# Altium project Buck.PrjPcb
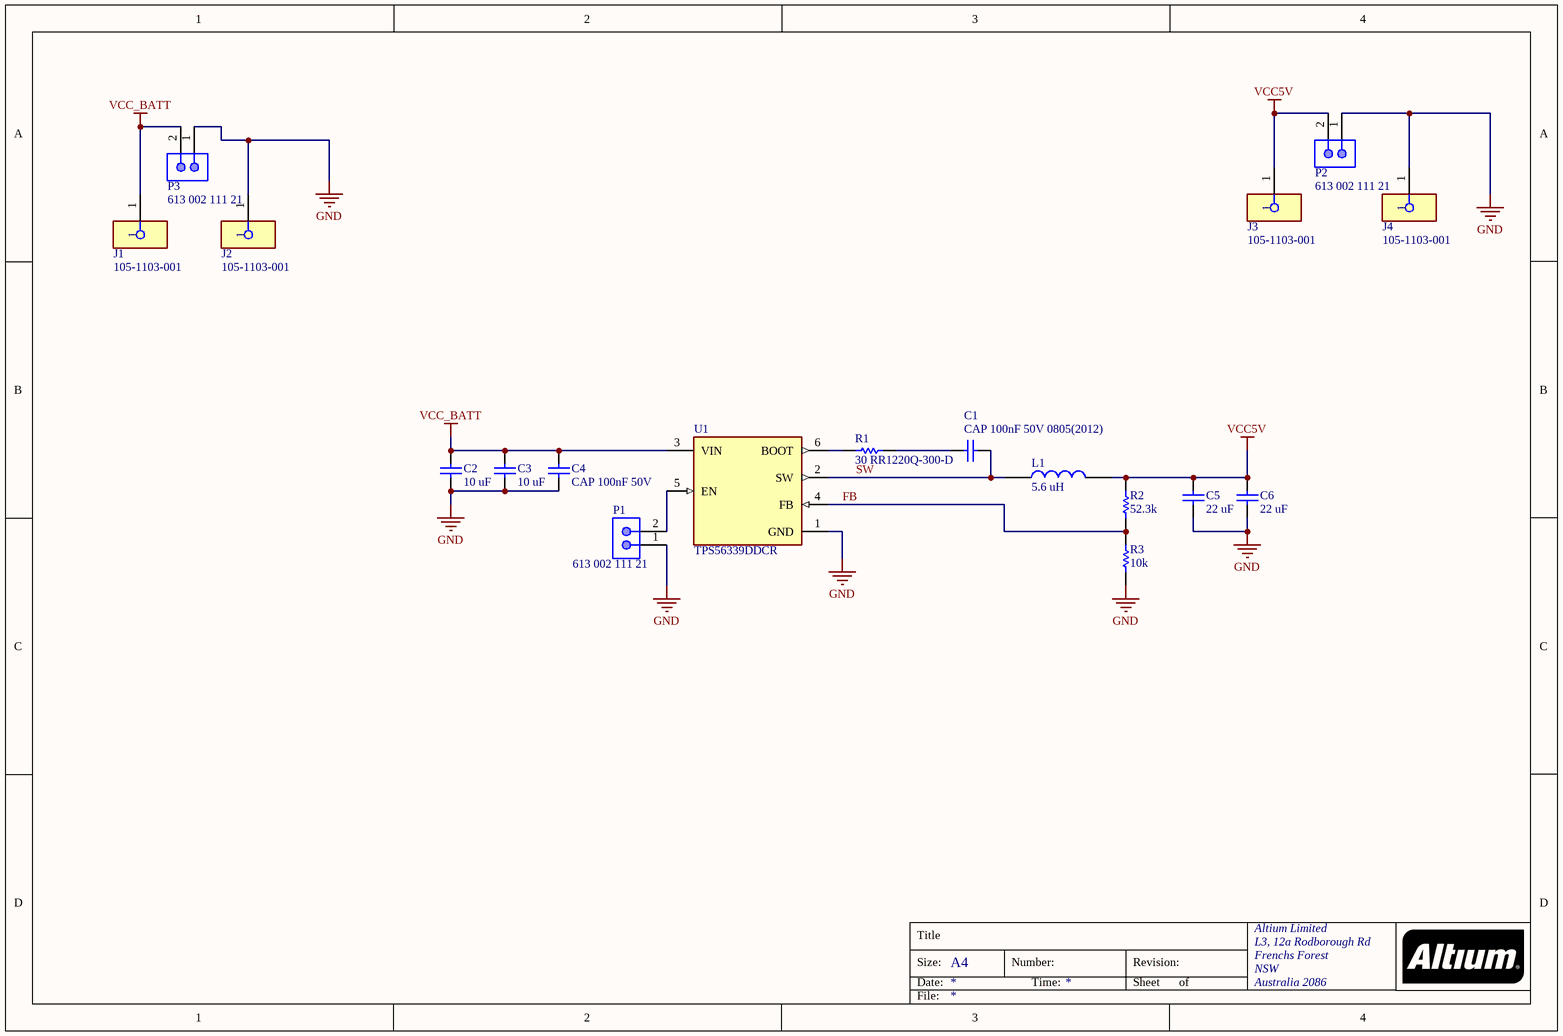
[diagram p0: Buck.SchDoc]
1 sheet, 18 parts. Net scope: global (net labels, ports and power ports of the same name join across sheets).
Board file: Buck.PcbDoc

## Sheet Buck.SchDoc
size A4; Organization: Altium Limited; Address1: L3, 12a Rodborough Rd; Address2: Frenchs Forest; Address3: NSW; Address4: Australia 2086

### Parts
C1  CAP 100nF 50V 0805(2012)  [CAPC0805(2012)100_M]
C2  10 uF  [CAPC1608X100X20VL10T10]
C3  10 uF  [CAPC1608X100X20VL10T10]
C4  CAP 100nF 50V  [CAPC0805(2012)100_M]
C5  22 uF  [CAPC3225X279X50LL20T25]
C6  22 uF  [CAPC3225X279X50LL20T25]
J1  105-1103-001  [FP-105-1103-001-MFG]
J2  105-1103-001  [FP-105-1103-001-MFG]
J3  105-1103-001  [FP-105-1103-001-MFG]
J4  105-1103-001  [FP-105-1103-001-MFG]
L1  5.6 uH  [470]
P1  613 002 111 21  [WE-61300211121_V]
P2  613 002 111 21  [WE-61300211121_V]
P3  613 002 111 21  [WE-61300211121_V]
R1  30 RR1220Q-300-D  [RESC2013X50X40LL20T20]
R2  52.3k  [RESC1609X50X30LL10T20]
R3  10k  [RESC1609X50X30NL8T20]
U1  TPS56339DDCR  [FP-DDC0006A-MFG]

### Nets
GND: C2.1 C3.1 C4.1 C5.1 C6.1 J2.1 J4.1 P1.1 P2.1 P3.1 R3.1 U1.1(GND)
VCC5V: C5.2 C6.2 J3.1 L1.2 P2.2 R2.2
VCC_BATT: C2.2 C3.2 C4.2 J1.1 P3.2 U1.3(VIN)
FB: R2.1 R3.2 U1.4(FB)
SW: C1.1 L1.1 U1.2(SW)
NetC1_2: C1.2 R1.2
NetP1_2: P1.2 U1.5(EN)
NetR1_1: R1.1 U1.6(BOOT)

### Notes on the sheet
- Title
- Size:
- Date:
- A4
- Number:
- Time:
- Revision:
- Sheet
- of
- File:

### Library data of the parts
C1 C4 = CMP-1036-04423-1: CAP 100nF 50V ±20% 0805 (2012 Metric) Thickness 1mm SMD; Case-Metric: 2012; Case-EIA: 0805; Tolerance: Â±20%; Technology: SMT; Rated Voltage: 50 V; Value: 100nF; Max Thickness: 1 mm
C2 C3 = CMP-2000-05442-1: Chip Capacitor, 10 uF, +/- 20%, 25 V, -55 to 85 degC, 0603 (1608 Metric), RoHS, Tape and Reel; Manufacturer: TDK; PCN Part Number: MLCCPartNumberChange30/Nov/2012; Other Names: 445-9015-1; Capacitance: 10µF; Design Resources: 20WNon-IsolatedBuckLEDDriverUsingPLLNK460KG; Kits: 445-9014-KIT-ND-KITMLCC100PF-22UF060310-50V; Voltage - Rated: 25V; Product Training Modules: SEAT,CCV,andTVCLDesignToolsGuidetoReplacinganElectrolyticCapacitorwithanMLCC; Online Catalog: CSeries,GeneralPurpose; Temperature Coefficient: X5R; Package Description: 2-Pin Surface Mount Device, Body 1.6 x 0.8 mm; Lead Style: -; Datasheet URL: http://download.siliconexpert.com/pdfs/2016/2/22/9/40/35/949/tdk_/manual/8010476609961980104703407078c1608x5r1e106m080ac.pdf.pdf; Category: Capacitors; Package / Case: 0603(1608Metric); Packaging: CutTape(CT); Series: C; Features: -; Family: CeramicCapacitors; Standard Package: 1; Tolerance: ±20%; Operating Temperature: -55degC~85degC; Mounting Type: SurfaceMount,MLCC; Ratings: -; Size / Dimension: 0.063"Lx0.031"W(1.60mmx0.80mm); Applications: GeneralPurpose; Package Reference: 1608; RoHS Information: RoHSCertificate-MLCC; Manufacturer URL: http://www.tdk.com/; Datasheet Version: Feb-16; Height - Seated (Max): -; Thickness (Max): 0.039"(1.00mm); Lead Spacing: -
C5 C6 = CMP-2000-05479-1: Chip Capacitor, 22 uF, +/- 20%, 25 V, -55 to 85 degC, 1210 (3225 Metric), RoHS, Tape and Reel; Manufacturer: AVX; Rated Voltage: 25V; Dielectric: X5R; Capacitance: 22µF; Datasheet URL: http://datasheets.avx.com/cx5r.pdf; Package Description: 2-Pin Surface Mount Device, Body 3.2 x 2.5 mm; Package Reference: 1210; Manufacturer URL: http://www.avx.com/; Case Size/Dimension: 1206; Tolerance (%): ±20%; Datasheet Version: 05/2016; Mounting Technology: SurfaceMount
J1-J4 = CMP-16032-000001-1: CONN TIP JACK SOLDER BLACK; Manufacturer: Bel Fuse; Conn Gender: Female; Number Of Contacts: 1; Current Rating: 5A; Voltage Rating: 1500V; Conn Orientation: Right Angle; Is Female: yes; Temperature Range Low: -55°C; Package: 105-1103-001; Lead Free: Yes; Contact Material: Silver; Digikey Description: CONN TIP JACK SOLDER BLACK; Height: 0.213inch; ComponentLink2URL: https://www.belfuse.com/resources/drawings/cinchconnectivitysolutions/johnson/dr-ccs-john-105-1103-001.pdf; Octopart: https://octopart.com/105-1103-001-bel+fuse-73381038; Device Class L3: unset; Device Class L2: Headers and Wire Housings; Automotive: No; ComponentLink2Description: Datasheet; Temperature Range High: +75°C; Manufacturer Part Number: 105-1103-001; Temperature: -55°C to +75°C; Number Of Rows: 1; Device Class L1: Connectors; Category: Conn; RoHS: TRUE
L1 = SRP6540-5R6M
P1-P3 = CMP-1712-00002-3: Male Header, Pitch 2.54 mm, 1 x 2 Position, Height 8.54 mm, Tail Length 3 mm, -40 to 105 degC, RoHS, Bulk; Mounting Technology: Through Hole; Packaging: Bulk; Pins: 2; REACH SVHC: No SVHC; PartNumber: 613 002 111 21; PackageDescription: Male Header, Pitch 2.54 mm, 1 x 2 Position, Height 8.54 mm, Tail Length 3 mm; ComponentLink1Description: Manufacturer URL; Max Operating Temperature: 125 degC; ComponentLink1URL: https://www.we-online.com/; ComponentLink2Description: Datasheet; Mount: Through Hole; DatasheetVersion: Rev. J; Min Operating Temperature: -40 degC; ComponentLink2URL: http://katalog.we-online.de/em/datasheet/6130xx11121.pdf; RoHSCompliant: True
R1 = CMP-2001-03553-1: Manufacturer: Susumu; Part Number: RR1220Q-300-D
R2 = CMP-2000-03451-1: Part Number: CRCW060352K3FKEA; Manufacturer: Vishay Dale
R3 = CMP-1666-00005-4: Chip Resistor, 10 KOhm, +/- 1%, 100 mW, -55 to 155 degC, 0603 (1608 Metric), RoHS, Tape and Reel; Manufacturer: Vishay Semiconductor; Voltage Rating: 75 V; Max Operating Temperature: 155 degC; PackageDescription: 2-Pin Surface Mount Device, Body 1.575 x 0.85 mm; ComponentLink1Description: Manufacturer URL; RoHSCompliant: true; PackageReference: 0603; REACH SVHC: Unknown; Length: 1.55 mm; DatasheetVersion: 06/2012; Packaging: Tape and Reel; Min Operating Temperature: -55 degC; Mounting Technology: Surface Mount; ComponentLink2URL: https://datasheet.ciiva.com/11809/0900766b80d98afc-11809037.pdf; Height: 0.45 mm; ComponentLink2Description: Datasheet; Package Quantity: 5000; ComponentLink1URL: http://www.vishay.com/
U1 = CMP-04918-000012-1: PWR MGMT SPECIALIZED REGULATOR; Manufacturer: Texas Instruments; Output Type: AdjustableProgrammable; Max Supply Voltage: 24V; Min Supply Voltage: 4.5V; Nominal Supply Current: 98uA; Max Duty Cycle: 97%; Number Of Outputs: 1; Output Current: 3A; Switching Topology: Buck; Standoff Height: 0mm; Switching Frequency: 500kHz; Output Voltage: 0.8-16V; Max Junction Temp: +125°C; ComponentLink2Description: Datasheet; ComponentLink2URL: http://www.ti.com/lit/ds/symlink/tps56339.pdf; Package: DDC0006A; RoHS: TRUE; Temperature: -40°C to +125°C; Temperature Range Low: -40°C; Device Class L3: Voltage Regulators - Switching; Temperature Range High: +125°C; Device Class L2: Power Management ICs; Device Class L1: Integrated Circuits (ICs); Category: IC; Manufacturer Part Number: TPS56339DDCR; Octopart: https://octopart.com/tps56339ddcr-texas+instruments-101466410; Automotive: No; Height: 1.1mm; Digikey Description: PWR MGMT SPECIALIZED REGULATOR; Lead Free: Yes; Mouser Description: 4.5-V to 24-V input, 3-A output synchronous buck converter 6-SOT-23-THIN -40 to 125